# Altium schematic sheet FPGA_Supply.SchDoc: =DocumentName
size A4; DocumentNumber: 1; Revision: 0; SheetNumber: 17; SheetTotal: 18
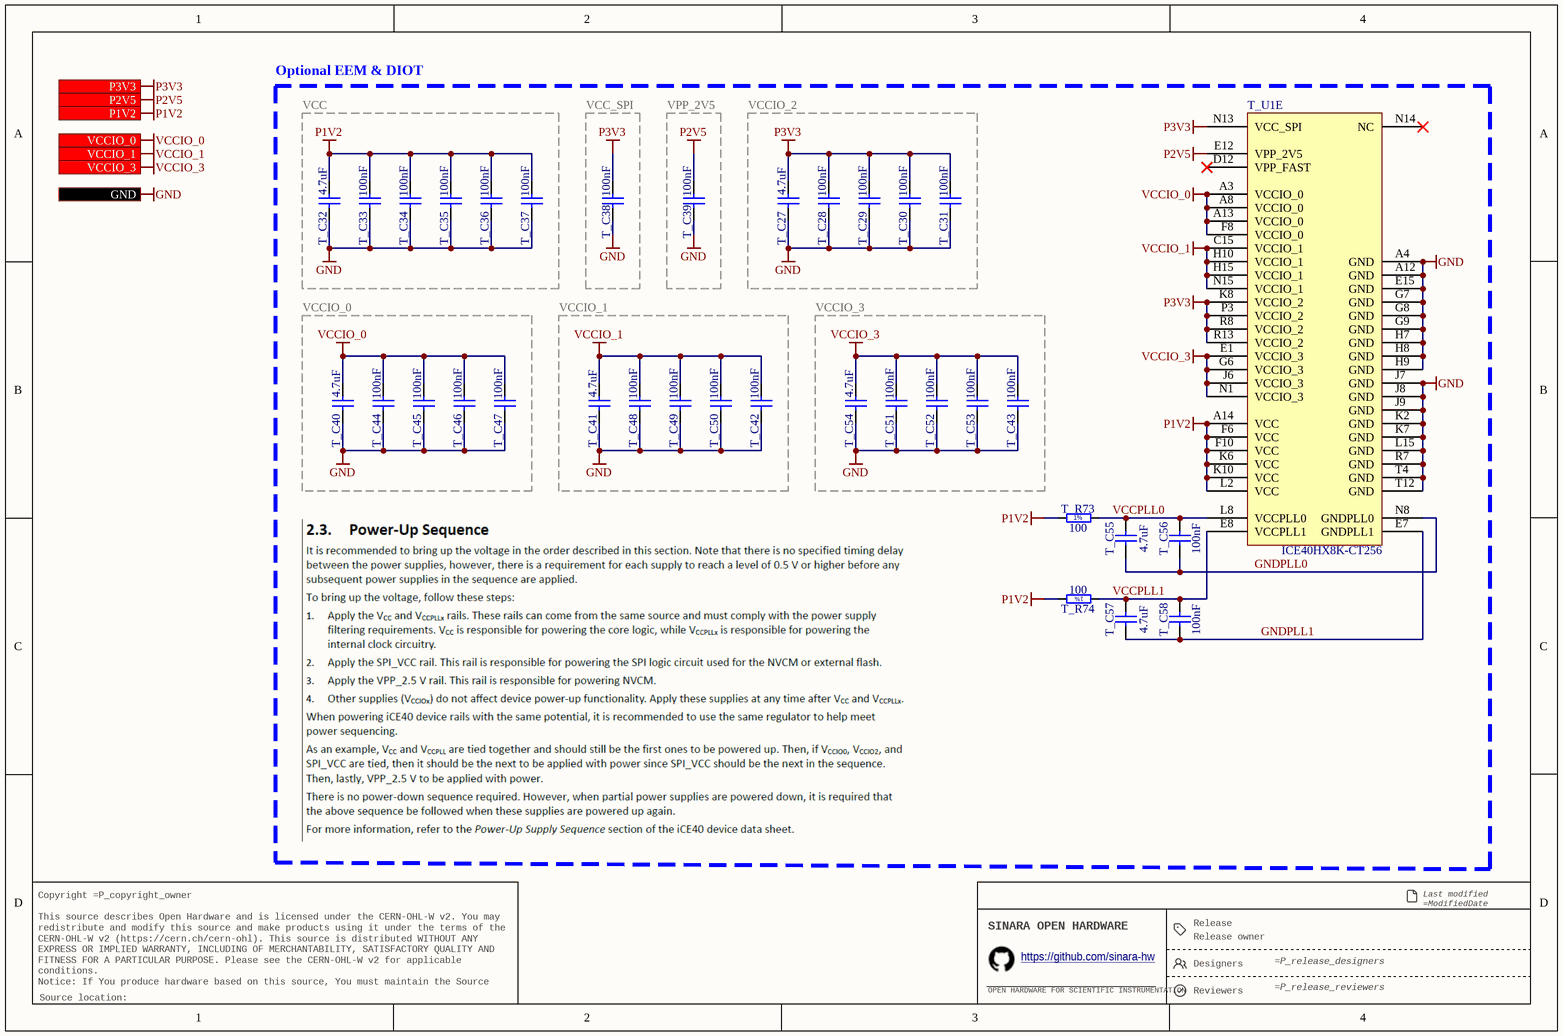
[diagram p0: FPGA_Supply.SchDoc]

## Parts
T_C27  4.7uF  [CAPC2012X135N]
T_C28  100nF  [CAPC1005X55N]
T_C29  100nF  [CAPC1005X55N]
T_C30  100nF  [CAPC1005X55N]
T_C31  100nF  [CAPC1005X55N]
T_C32  4.7uF  [CAPC2012X135N]
T_C33  100nF  [CAPC1005X55N]
T_C34  100nF  [CAPC1005X55N]
T_C35  100nF  [CAPC1005X55N]
T_C36  100nF  [CAPC1005X55N]
T_C37  100nF  [CAPC1005X55N]
T_C38  100nF  [CAPC1005X55N]
T_C39  100nF  [CAPC1005X55N]
T_C40  4.7uF  [CAPC2012X135N]
T_C41  4.7uF  [CAPC2012X135N]
T_C42  100nF  [CAPC1005X55N]
T_C43  100nF  [CAPC1005X55N]
T_C44  100nF  [CAPC1005X55N]
T_C45  100nF  [CAPC1005X55N]
T_C46  100nF  [CAPC1005X55N]
T_C47  100nF  [CAPC1005X55N]
T_C48  100nF  [CAPC1005X55N]
T_C49  100nF  [CAPC1005X55N]
T_C50  100nF  [CAPC1005X55N]
T_C51  100nF  [CAPC1005X55N]
T_C52  100nF  [CAPC1005X55N]
T_C53  100nF  [CAPC1005X55N]
T_C54  4.7uF  [CAPC2012X135N]
T_C55  4.7uF  [CAPC2012X135N]
T_C56  100nF  [CAPC1005X55N]
T_C57  4.7uF  [CAPC2012X135N]
T_C58  100nF  [CAPC1005X55N]
T_R73  100  [RESC1005X40N]
T_R74  100  [RESC1005X40N]
T_U1  ICE40HX8K-CT256  [LATC-caBGA-256]  (part E of 5)

## Blocks framed on the sheet
Optional EEM & DIOT: T_C55-T_C58 T_R73 T_R74 T_U1
VCC: T_C32-T_C37
VCC_SPI: T_C38
VPP_2V5: T_C39
VCCIO_2: T_C27-T_C31
VCCIO_0: T_C40 T_C44-T_C47
VCCIO_1: T_C41 T_C42 T_C48-T_C50
VCCIO_3: T_C43 T_C51-T_C54

## Ports
GND, P1V2 (in), P2V5 (in), P3V3 (in), VCCIO_0 (in), VCCIO_1 (in), VCCIO_3 (in)

## Nets
GND: T_C27.1 T_C28.1 T_C29.1 T_C30.1 T_C31.1 T_C32.1 T_C33.1 T_C34.1 T_C35.1 T_C36.1 T_C37.1 T_C38.1 T_C39.1 T_C40.1 T_C41.1 T_C42.1 T_C43.1 T_C44.1 T_C45.1 T_C46.1 T_C47.1 T_C48.1 T_C49.1 T_C50.1 T_C51.1 T_C52.1 T_C53.1 T_C54.1 T_U1.A4(GND) T_U1.A12(GND) T_U1.E15(GND) T_U1.G7(GND) T_U1.G8(GND) T_U1.G9(GND) T_U1.H7(GND) T_U1.H8(GND) T_U1.H9(GND) T_U1.J7(GND) T_U1.J8(GND) T_U1.J9(GND) T_U1.K2(GND) T_U1.K7(GND) T_U1.L15(GND) T_U1.R7(GND) T_U1.T4(GND) T_U1.T12(GND) ; port GND
P1V2: T_C32.2 T_C33.2 T_C34.2 T_C35.2 T_C36.2 T_C37.2 T_R73.1 T_R74.2 T_U1.A14(VCC) T_U1.F6(VCC) T_U1.F10(VCC) T_U1.K6(VCC) T_U1.K10(VCC) T_U1.L2(VCC) ; port P1V2
P2V5: T_C39.2 T_U1.E12(VPP_2V5) ; port P2V5
P3V3: T_C27.2 T_C28.2 T_C29.2 T_C30.2 T_C31.2 T_C38.2 T_U1.K8(VCCIO_2) T_U1.N13(VCC_SPI) T_U1.P3(VCCIO_2) T_U1.R8(VCCIO_2) T_U1.R13(VCCIO_2) ; port P3V3
VCCIO_0: T_C40.2 T_C44.2 T_C45.2 T_C46.2 T_C47.2 T_U1.A3(VCCIO_0) T_U1.A8(VCCIO_0) T_U1.A13(VCCIO_0) T_U1.F8(VCCIO_0) ; port VCCIO_0
VCCIO_1: T_C41.2 T_C42.2 T_C48.2 T_C49.2 T_C50.2 T_U1.C15(VCCIO_1) T_U1.H10(VCCIO_1) T_U1.H15(VCCIO_1) T_U1.N15(VCCIO_1) ; port VCCIO_1
VCCIO_3: T_C43.2 T_C51.2 T_C52.2 T_C53.2 T_C54.2 T_U1.E1(VCCIO_3) T_U1.G6(VCCIO_3) T_U1.J6(VCCIO_3) T_U1.N1(VCCIO_3) ; port VCCIO_3
GNDPLL0: T_C55.1 T_C56.1 T_U1.N8(GNDPLL0)
GNDPLL1: T_C57.1 T_C58.1 T_U1.E7(GNDPLL1)
VCCPLL0: T_C55.2 T_C56.2 T_R73.2 T_U1.L8(VCCPLL0)
VCCPLL1: T_C57.2 T_C58.2 T_R74.1 T_U1.E8(VCCPLL1)

Not connected (* = marked no-connect by the designer): T_U1 D12(VPP_FAST)* N14(NC)*

## Notes on the sheet
- Release
- Last modified =ModifiedDate
  Sheet =sheetnumber of =sheettotal · Size A4
- Copyright =P_copyright_owner
  This source describes Open Hardware and is licensed under the CERN-OHL-W v2. You may redistribute and modify this source and make products using it under the terms of the CERN-OHL-W v2 (https://cern.ch/cern-ohl). This source is distributed WITHOUT ANY EXPRESS OR IMPLIED WARRANTY, INCLUDING OF MERCHANTABILITY, SATISFACTORY QUALITY AND FITNESS FOR A PARTICULAR PURPOSE. Please see the CERN-OHL-W v2 for applicable conditions.
  Notice: If You produce hardware based on this source, You must maintain the Source Location visible on the product, its packaging or its documentation.
- SINARA OPEN HARDWARE
- OPEN HARDWARE FOR SCIENTIFIC INSTRUMENTATION
- https://github.com/sinara-hw
- Release owner
- Designers
- Reviewers
- Source location:
- (in symbol R0402_100R_1%_0.0625W_100PPM) 1%

## Library data of the parts
T_C27 T_C32 T_C40 T_C41 T_C54 T_C55 T_C57 = CC0805_4.7UF_16V_10%_X7R: Non-polarised capacitor; Part Description: SMD Multilayer Chip Ceramic Capacitor; Manufacturer: GENERIC; Manufacturer1 Part Number: EMK212B7475KG-T; Voltage: 16V; TC: X7R; Tolerance: ±10%; Part Number: CC0805_4.7UF_16V_10%_X7R; Component Kind: Standard; Component Type: Standard; Pin Count: 2; Value: 4.7uF; Status: Preferred; Manufacturer Part Number: CC0805_4.7UF_16V_10%_X7R; Case: 0805; Mounted: Yes; Socket: No; SMD: Yes; Sense: No; Manufacturer1 Example: TAIYO YUDEN; Manufacturer1 ComponentHeight: 1.35mm; HelpURL: \\cern.ch\dfs\Applications\Altium\Datasheets\CC0805_X7R_TAIYO-YUDEN_HIGH-VALUE.pdf; Author: CERN DEM JLC; CreateDate: 16.09.2014; LatestRevisionDate: 16.09.2014
T_C28-T_C31 T_C33-T_C39 T_C42-T_C53 T_C56 T_C58 = CC0402_100NF_50V_10%_X7R: Non-polarised capacitor; Part Description: SMD Multilayer Chip Ceramic Capacitor; Manufacturer: GENERIC; Manufacturer1 Part Number: GRM155R71H104KE14D; Voltage: 50V; TC: X7R; Tolerance: ±10%; Part Number: CC0402_100NF_50V_10%_X7R; Component Kind: Standard; Component Type: Standard; Pin Count: 2; Value: 100nF; Status: None; Manufacturer Part Number: CC0402_100NF_50V_10%_X7R; Case: 0402; Mounted: Yes; Socket: No; SMD: Yes; Manufacturer1 Example: MURATA; Manufacturer1 ComponentHeight: 0.55mm; HelpURL: \\cern.ch\dfs\Applications\Altium\Datasheets\CC0402_MURATA_GRM155R71H104KE14D.pdf; Author: CERN DEM MR; CreateDate: 30.06.2017; LatestRevisionDate: 30.06.2017; Sense: No
T_R73 T_R74 = R0402_100R_1%_0.0625W_100PPM: Resistor - 1%; Part Description: General Purpose Thick Film Chip Resistor; Manufacturer: GENERIC; Manufacturer1 Part Number: 232270671001L; TC: ±100ppm/°C; Table: Resistors SMD; Part Number: R0402_100R_1%_0.0625W_100PPM; Component Kind: Standard; Component Type: Standard; Pin Count: 2; Value: 100; Status: Not recommended; Power: 0.0625W; Tolerance: ±1%; Manufacturer Part Number: R0402_100R_1%_0.0625W_100PPM; Case: 0402; Mounted: Yes; Socket: No; SMD: Yes; Manufacturer1 Example: YAGEO PHYCOMP; Manufacturer1 ComponentHeight: 0.4mm; HelpURL: \\cern.ch\dfs\Applications\Altium\Datasheets\R0402_Phycomp_RC0402.pdf; Author: CERN DEM JLC; CreateDate: 2007-12-03; LatestRevisionDate: 2012-10-17
T_U1 = CMP-0962-00001-1: iCE40 HX8K Series FPGA Family, 7680 Logic Cells, 1.2 V Core, 128 K Embedded RAM Bits, 256-ball caBGA, Pb-Free, Tray; Manufacturer: Lattice Semiconductor; Supply Voltage: 1.2V; Phase-Locked Loops: 2; Logic Cells: 7680; Embedded RAM Bits: 128K; PackageReference: caBGA-256; PackageDescription: 256-Ball Chip Array Ball Grid Array, Body 14 x 14 mm, Pitch 0.8 mm; RoHS: TRUE; Packing: Tray; Mounting Technology: Surface Mount; ComponentLink3URL: http://www.latticesemi.com/lit/docs/package/pkg.pdf; ComponentLink1Description: Manufacturer URL; ComponentLink3Description: Package Specification; Code_JEDEC: MO-275; PackageVersion: Rev. 03.9, 02/2013; ComponentLink1URL: http://www.latticesemi.com/en; ComponentLink2URL: http://www.latticesemi.com/~/media/Documents/DataSheets/iCE/iCE40LPHXFamilyDataSheet.pdf; Manufacturer Part Number: ICE40HX8K-CT256; ComponentLink2Description: Datasheet; DatasheetVersion: Rev. 02.9